# Altium schematic sheet NNLightSwitcher_USB.SchDoc
size A4
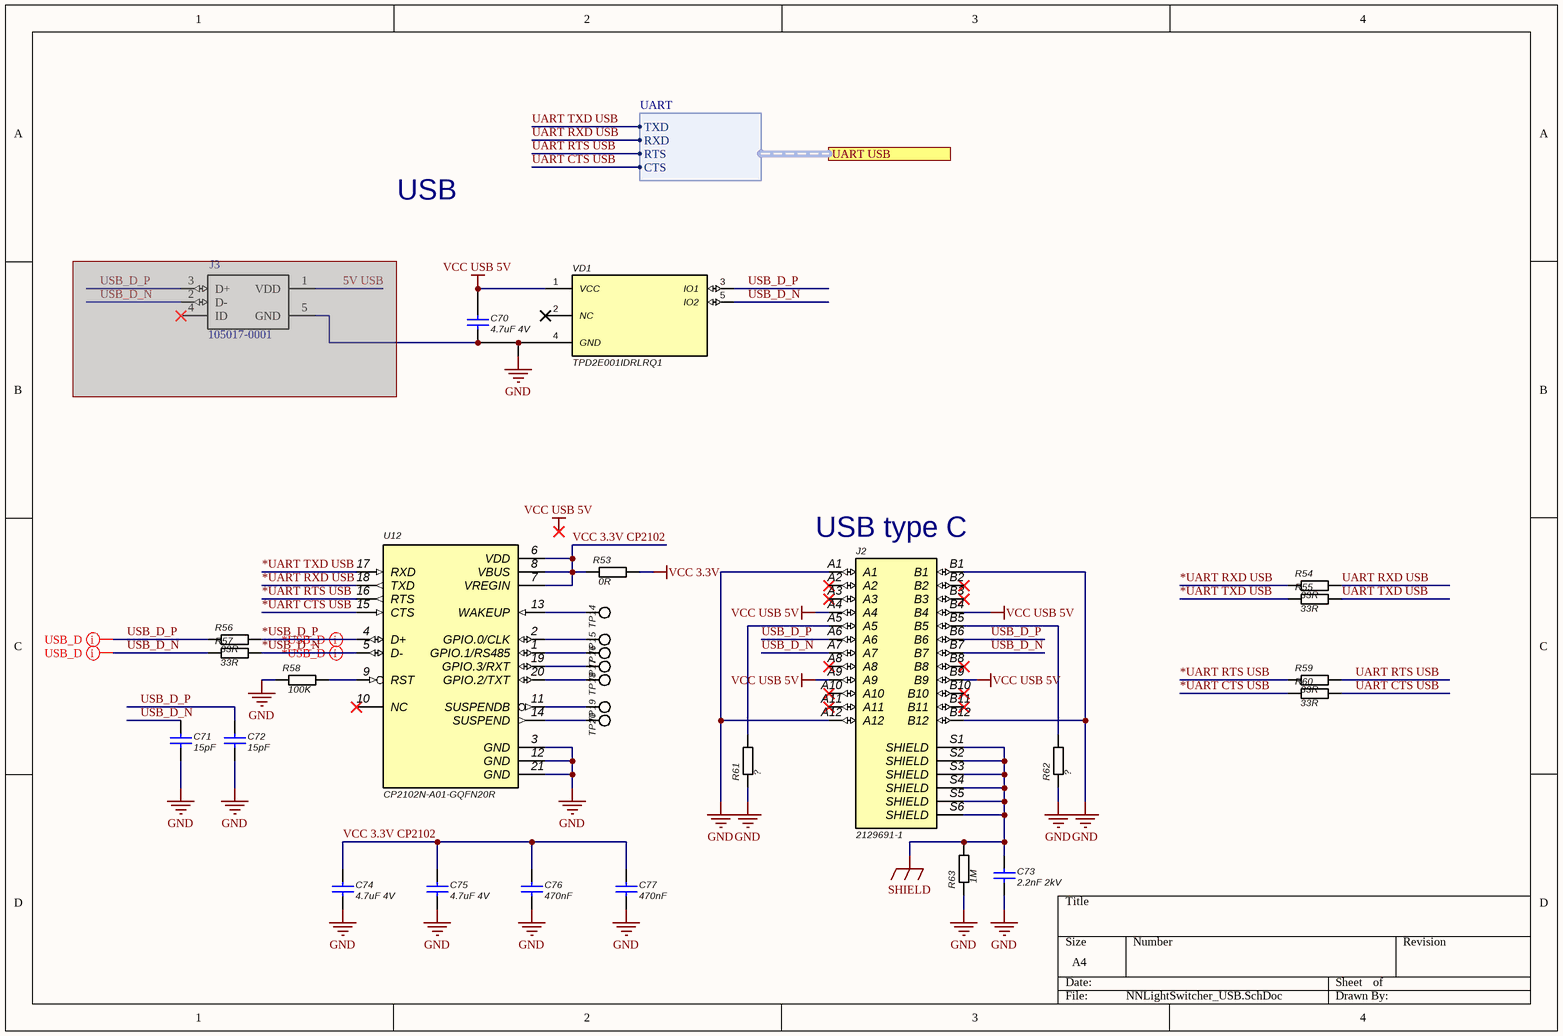
[diagram p0: NNLightSwitcher_USB.SchDoc]

## Parts
C70  4.7uF 4V  [0402]
C71  15pF  [0402]
C72  15pF  [0402]
C73  2.2nF 2kV  [0402]
C74  4.7uF 4V  [0402]
C75  4.7uF 4V  [0402]
C76  470nF  [0402]
C77  470nF  [0402]
J2  2129691-1  [*TE_2129691-1_2129691-1(Primary)]
J3  105017-0001  [MOLEX_105017-0001]  (masked out: inside a compile mask, not in the netlist)
R53  0R  [0402]
R54  33R  [0402]
R55  33R  [0402]
R56  33R  [0402]
R57  33R  [0402]
R58  100K  [0402]
R59  33R  [0402]
R60  33R  [0402]
R61  ?  [0402]
R62  ?  [0402]
R63  1M  [0402]
TP14  Test point  [Testpoint_Keystone_Miniature]  (value not drawn)
TP15  Test point  [Testpoint_Keystone_Miniature]  (value not drawn)
TP16  Test point  [Testpoint_Keystone_Miniature]  (value not drawn)
TP17  Test point  [Testpoint_Keystone_Miniature]  (value not drawn)
TP18  Test point  [Testpoint_Keystone_Miniature]  (value not drawn)
TP19  Test point  [Testpoint_Keystone_Miniature]  (value not drawn)
TP20  Test point  [Testpoint_Keystone_Miniature]  (value not drawn)
U12  CP2102N-A01-GQFN20R  [*SILABS_QFN20]
VD1  TPD2E001IDRLRQ1  [SOT50P160X60-5N]

## Ports
UART USB (harness UART)

## Harnesses
UART: RXD, RTS, TXD, CTS

## Nets
GND: C70.2 C71.2 C72.2 C73.2 C74.2 C75.2 C76.2 C77.2 J2.A1 J2.A12 J2.B1 J2.B12 R58.1 R61.1 R62.1 R63.1 U12.3(GND) U12.12(GND) U12.21(GND) VD1.4(GND)
SHIELD: C73.1 J2.S1(SHIELD) J2.S2(SHIELD) J2.S3(SHIELD) J2.S4(SHIELD) J2.S5(SHIELD) J2.S6(SHIELD) R63.2
VCC 3.3V: R53.2
VCC USB 5V: C70.1 J2.A4 J2.A9 J2.B4 J2.B9 VD1.1(VCC)
*UART CTS USB: R60.1 U12.15(CTS)
*UART RTS USB: R59.1 U12.16(RTS)
*UART RXD USB: R54.1 U12.18(TXD)
*UART TXD USB: R55.1 U12.17(RXD)
*USB_D_N: R57.2 U12.5(D-)
*USB_D_P: R56.2 U12.4(D+)
UART CTS USB: R60.2 ; port UART USB.CTS
UART RTS USB: R59.2 ; port UART USB.RTS
UART RXD USB: R54.2 ; port UART USB.RXD
UART TXD USB: R55.2 ; port UART USB.TXD
USB_D_N: C71.1 J2.A7 J2.B7 R57.1 VD1.5(IO2)
USB_D_P: C72.1 J2.A6 J2.B6 R56.1 VD1.3(IO1)
VCC 3.3V CP2102: C74.1 C75.1 C76.1 C77.1 R53.1 U12.6(VDD) U12.7(VREGIN) U12.8(VBUS)
NetJ2_A5: J2.A5 R61.2
NetJ2_B5: J2.B5 R62.2
NetR58_2: R58.2 U12.9(RST)
NetTP14_1: TP14.1 U12.13(WAKEUP)
NetTP15_1: TP15.1 U12.2(GPIO.0/CLK)
NetTP16_1: TP16.1 U12.1(GPIO.1/RS485)
NetTP17_1: TP17.1 U12.19(GPIO.3/RXT)
NetTP18_1: TP18.1 U12.20(GPIO.2/TXT)
NetTP19_1: TP19.1 U12.11(SUSPENDB)
NetTP20_1: TP20.1 U12.14(SUSPEND)

Not connected (* = marked no-connect by the designer): J2 A2* A3* A8* A10* A11* B2* B3* B8* B10* B11*; U12 10(NC)*; VD1 2(NC)*

## Layout directives
differential pair: *USB_D_N, *USB_D_P, USB_D_N, USB_D_P

## Notes on the sheet
- USB
- (near J2) USB type C
- Labels drawn without touching a wire or pin: VCC USB 5V

## Library data of the parts
C70 C74 C75 = Capacitor 4.7uF 4V: ComponentLink1Description: Datasheet link; ComponentLink1URL: http://www.yageo.com/documents/recent/UPY-GP_NP0_16V-to-50V_16.pdf
C71 C72 = Capacitor 15pF: ComponentLink1Description: Datasheet link; ComponentLink1URL: http://www.yageo.com/documents/recent/UPY-GP_NP0_16V-to-50V_16.pdf
C73 = Capacitor 2.2nF 2kV: ComponentLink1Description: Datasheet link; ComponentLink1URL: http://www.yageo.com/documents/recent/UPY-GP_NP0_16V-to-50V_16.pdf
C76 C77 = Capacitor 470nF: ComponentLink1Description: Datasheet link; ComponentLink1URL: http://www.yageo.com/documents/recent/UPY-GP_NP0_16V-to-50V_16.pdf
J2 = USB type C: Conn USB 3.1 Type C RCP 24 POS Solder RA SMD/Thru-Hole 24 Terminal 1 Port Automotive T/R; Manufacturer 1: TE Connectivity AMP; Product_Type: Connector; Centerline_Pitch: .5 mm[.019 in]; Number_of_Positions: 24; MF: TE Connectivity; Plating: Bright; Gender: Receptacle; Plating Thickness: 0.75um; Number of Ports: 1; USB Standard: USB 3.1; Contact Current Rating: 5A; Circuit Application: Signal; Connector System: Cable-to-Board; Pitch: 0.5mm; TE_purchase_URL: https://www.te.com/usa-en/product-2129691-1.html?te_bu=Cor&te_type=disp&te_campaign=seda_glo_cor-seda-global-disp-prtnr-fy19-seda-model-bom-cta_sma-317_1&elqCampaignId=32493; Package: None; MP: 2129691-1; Price: None; Availability: Unavailable; SnapEDA_Link: https://www.snapeda.com/parts/2129691-1/TE%20Connectivity%20AMP%20Connectors/view-part/?ref=snap; Value: *; Supplier 1: Mouser; Manufacturer Part Number 1: 2129691-1; Stock 1: 8733; Pricing 1: 1=2,88000, 10=2,76000, 25=2,53000, 50=2,42000, 100=2,30000, 250=2,01000, 500=1,96000, 1000=1,67000, 2000=1,65000, 10000=1,65000 (USD); RoHS: Yes; Mount: Surface Mount; Number of Pins: 24; Contact Material: Copper Alloy; Contact Plating: Nickel,Gold; Housing Color: Black; Housing Material: Thermoplastic; Min Operating Temperature: -30°C; Max Operating Temperature: 85°C; Orientation: Right Angle; Packaging: Tape and Reel; Termination: Solder; Connector Type: Receptacle; Number of Positions: 24; Length: 12.35mm; REACH SVHC: Unknown; Lead Free: Lead Free; ComponentLink1URL: https://media.digikey.com/pdf/Data%20Sheets/Tyco%20Electonics%20AMP%20PDFs/2129691_Dwg.pdf?src-supplier=Digi-Key; ComponentLink1Description: https://media.digikey.com/pdf/Data%20Sheets/Tyco%20Electonics%20AMP%20PDFs/2129691_Dwg.pdf?src-supplier=Digi-Key; ComponentLink2URL: http://www.farnell.com/datasheets/2292385.pdf?src-supplier=Farnell; ComponentLink2Description: http://www.farnell.com/datasheets/2292385.pdf?src-supplier=Farnell; ComponentLink3URL: http://www.farnell.com/datasheets/1993946.pdf?src-supplier=Farnell; ComponentLink3Description: http://www.farnell.com/datasheets/1993946.pdf?src-supplier=Farnell; ComponentLink4URL: http://www.alliedelec.com/images/products/datasheets/bm/TE_Connectivity/70718395.pdf?src-supplier=Allied+Electronics; ComponentLink4Description: http://www.alliedelec.com/images/products/datasheets/bm/TE_Connectivity/70718395.pdf?src-supplier=Allied+Electronics; ComponentLink5URL: http://www.farnell.com/cad/1993947.pdf?src-supplier=Element14; ComponentLink5Description: http://www.farnell.com/cad/1993947.pdf?src-supplier=Element14; ComponentLink6URL: http://www.farnell.com/datasheets/1993946.pdf?src-supplier=Element14; ComponentLink6Description: http://www.farnell.com/datasheets/1993946.pdf?src-supplier=Element14; ComponentLink7URL: http://www.te.com/commerce/DocumentDelivery/DDEController?Action=showdoc&DocId=Customer+Drawing%7F2129691%7F6%7Fpdf%7FEnglish%7FENG_CD_2129691_6.pdf%7F2129691-1&src-supplier=Avnet+Asia; ComponentLink7Description: http://www.te.com/commerce/DocumentDelivery/DDEController?Action=showdoc&DocId=Customer+Drawing%7F2129691%7F6%7Fpdf%7FEnglish%7FENG_CD_2129691_6.pdf%7F2129691-1&src-supplier=Avnet+Asia; ComponentLink8URL: http://www.te.com/commerce/DocumentDelivery/DDEController?Action=showdoc&DocId=Customer+Drawing%7F2129691%7F6%7Fpdf%7FEnglish%7FENG_CD_2129691_6.pdf%7F2129691-1&src-supplier=Avnet; ComponentLink8Description: http://www.te.com/commerce/DocumentDelivery/DDEController?Action=showdoc&DocId=Customer+Drawing%7F2129691%7F6%7Fpdf%7FEnglish%7FENG_CD_2129691_6.pdf%7F2129691-1&src-supplier=Avnet; Supplier Part Number 1: 571-2129691-1
J3 = 105017-0001: Conn USB Type B M 5 POS 0.65mm Solder RA Thru-Hole 5 Terminal 1 Port Embossed T/R; MF: Molex; Package: None; MP: 105017-0001; Availability: Good; Price: 0.50 USD; Value: *
R53 = Resistor 0R
R54-R57 R59 R60 = Resistor 33R
R58 = Resistor 100K
R61 R62 = Resistor generic
R63 = Resistor 1M
TP14-TP20 = Test point: Test Point, Miniature, SMT; ComponentLink1Description: Datasheet URL; ComponentLink1URL: http://www.keyelco.com/userAssets/store/files/5015.PDF
U12 = CP2102N-A01-GQFN20R: Ic Bridge Usb To Uart 20qfn; Manufacturer 1: Silicon Labs; Value: *; ComponentLink1Description: https://www.silabs.com/documents/public/data-sheets/cp2102n-datasheet.pdf?src-supplier=Digi-Key; ComponentLink1URL: https://www.silabs.com/documents/public/data-sheets/cp2102n-datasheet.pdf?src-supplier=Digi-Key; Manufacturer 2: Silicon Labs; Manufacturer Part Number 1: CP2102N-A01-GQFN20R; Manufacturer Part Number 2: CP2102N-A01-GQFN20R; Pricing 1: 1=1,33000, 10=1,31000, 25=1,28000, 50=1,26000, 100=1,23000, 250=1,21000, 500=1,19000, 1000=1,15000, 10000=1,15000 (USD); Pricing 2: 1=1,33000, 25=1,28080, 100=1,23170 (USD); RoHS: No; Stock 1: 3771; Stock 2: 12524; Supplier 1: Mouser; Supplier 2: Digi-Key; Supplier Part Number 1: 634-CP21NA01GQFN20R; Supplier Part Number 2: 336-4826-1-ND
VD1 = TPD2E001IDRLRQ1: Automotive Catalog Low-Capacitance 2-Channel %2B/-15 kV ESD-Protection Array for High-Speed Data Inter 5-SOT -40 to 85